# EAGLE schematic main (EAGLE 6.4)
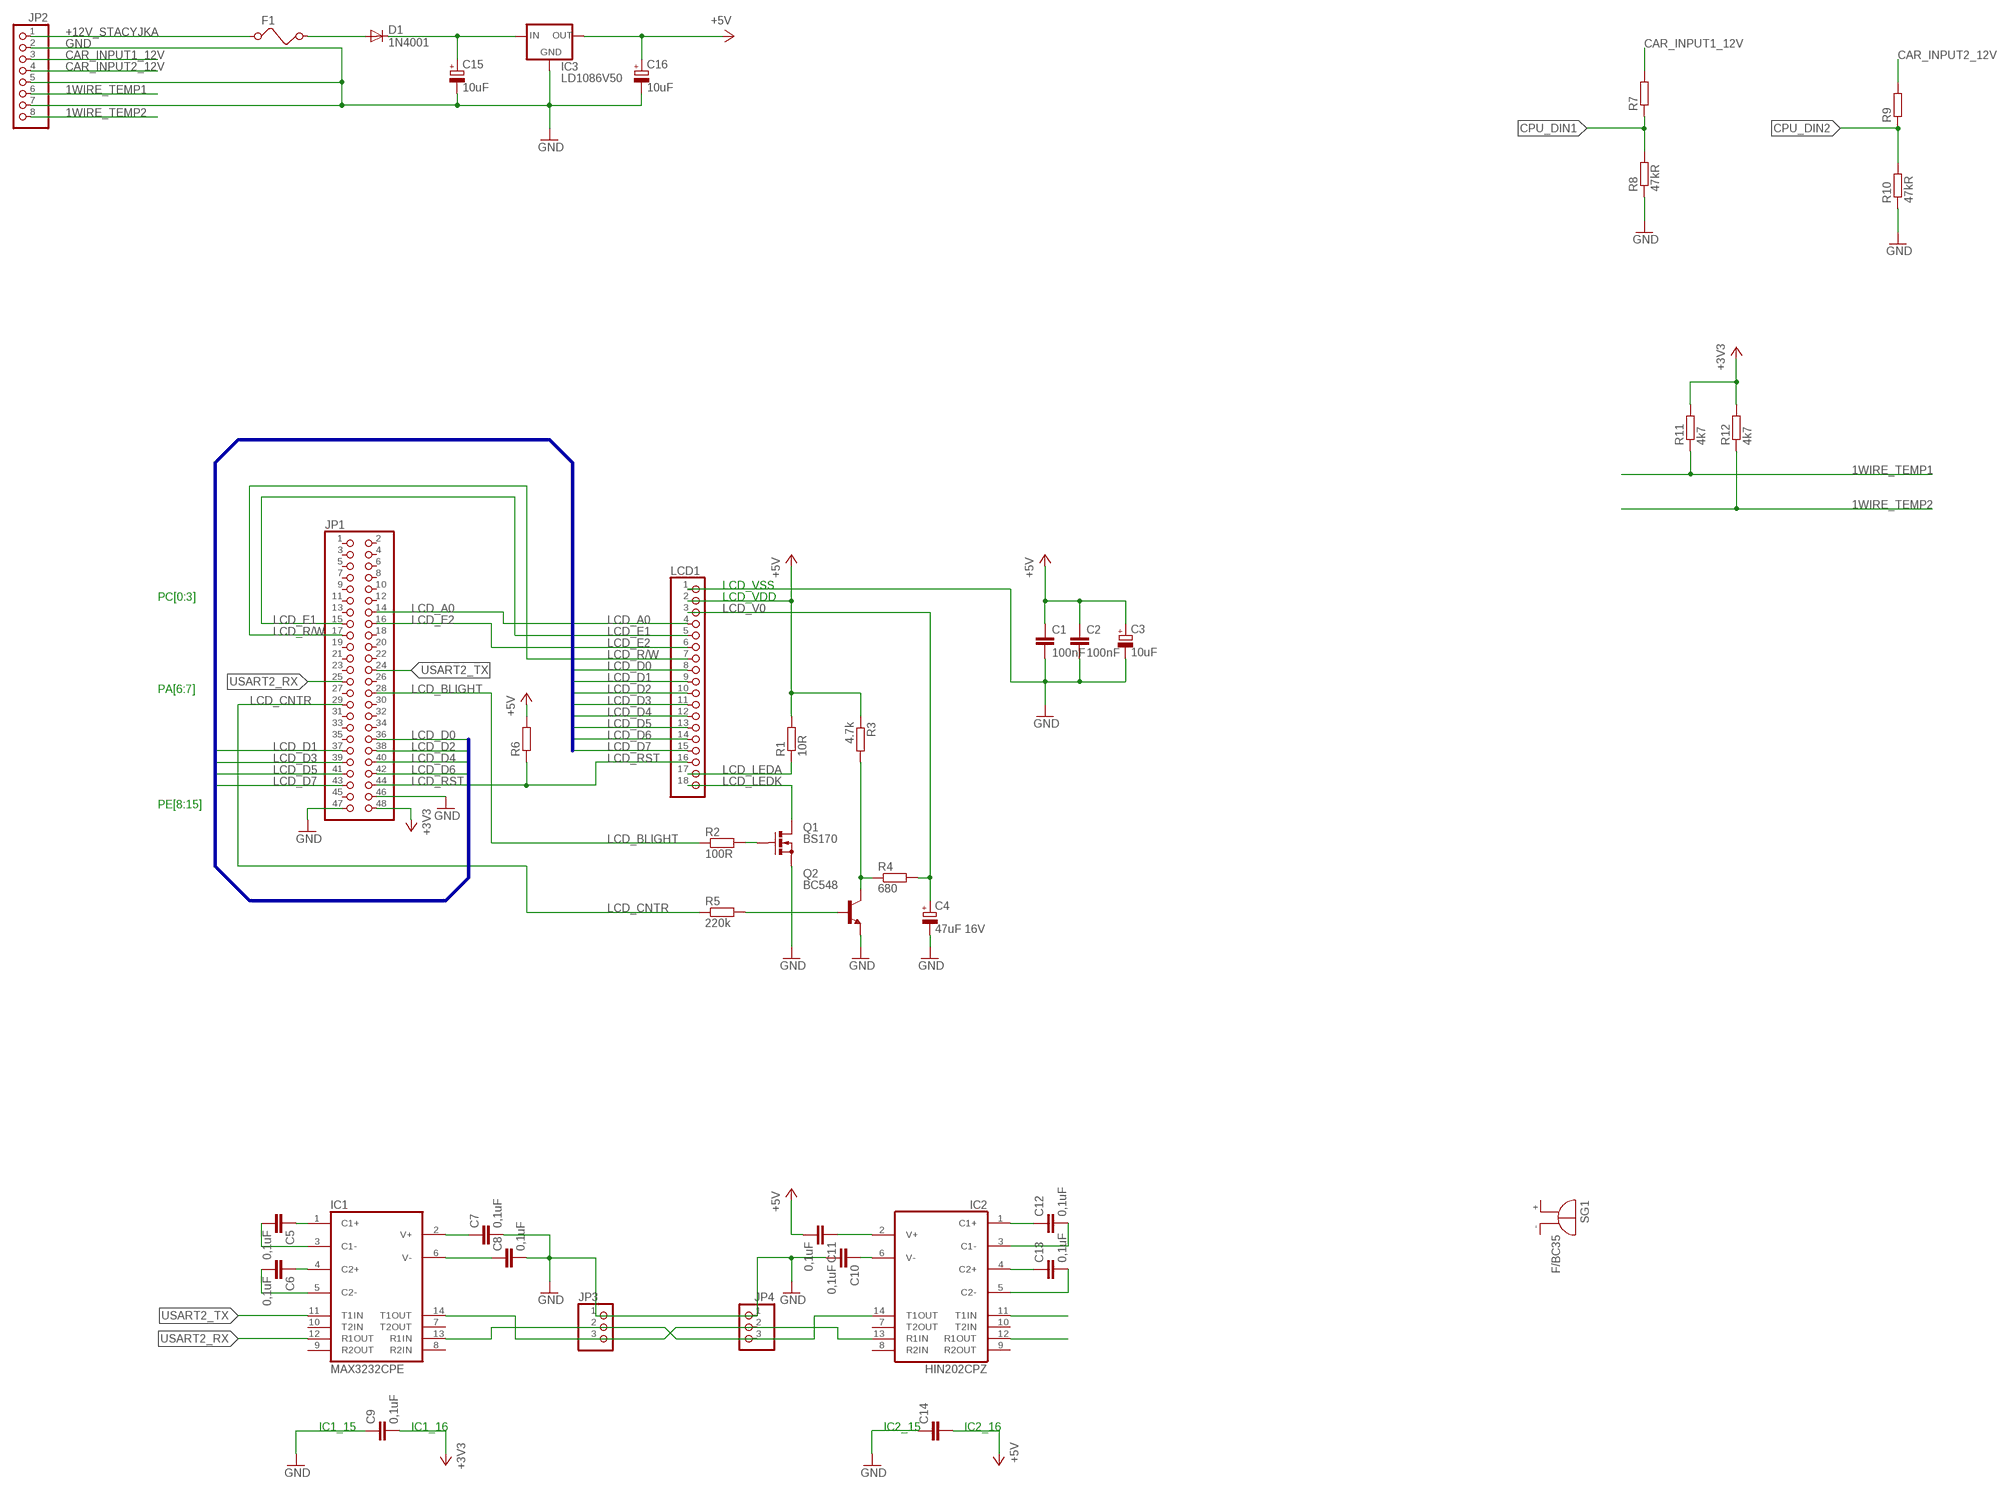
[diagram p0: schematic, sheet 1]

## Parts
C1  100nF  C-EU025-024X044  [C025-024X044]
C2  100nF  C-EU025-024X044  [C025-024X044]
C3  10uF  CPOL-EU085CS-1AR  [085CS_1AR]
C4  47uF 16V  CPOL-EU085CS-1AR  [085CS_1AR]
C5  0,1uF  C-EU025-024X044  [C025-024X044]
C6  0,1uF  C-EU025-024X044  [C025-024X044]
C7  0,1uF  C-EU025-024X044  [C025-024X044]
C8  0,1uF  C-EU025-024X044  [C025-024X044]
C9  0,1uF  C-EU025-024X044  [C025-024X044]
C10  0,1uF  C-EU025-024X044  [C025-024X044]
C11  0,1uF  C-EU025-024X044  [C025-024X044]
C12  0,1uF  C-EU025-024X044  [C025-024X044]
C13  0,1uF  C-EU025-024X044  [C025-024X044]
C14  C-EU025-024X044  [C025-024X044]
C15  10uF  CPOL-EU085CS-1AR  [085CS_1AR]
C16  10uF  CPOL-EU085CS-1AR  [085CS_1AR]
D1  1N4001  1N4004  [DO41-10]
F1  FUSE  [FUSE]
IC1  MAX3232CPE  [DIL16]
IC2  HIN202CPZ  MAX3232CPE  [DIL16]
IC3  LD1086V50  78MXXL  [78MXXL]
JP1  PINHD-2X24  [2X24]
JP2  PINHD-1X8  [1X08]
JP3  PINHD-1X3  [1X03]
JP4  PINHD-1X3  [1X03]
LCD1  PINHD-1X18  [1X18]
Q1  BS170  [SOT54E]
Q2  BC548  [TO92-EBC]
R1  10R  R-EU_0204/2V  [0204V]
R2  100R  R-EU_0204/2V  [0204V]
R3  4.7k  R-EU_0204/2V  [0204V]
R4  680  R-EU_0204/2V  [0204V]
R5  220k  R-EU_0204/2V  [0204V]
R6  R-EU_0204/2V  [0204V]
R7  R-EU_0204/2V  [0204V]
R8  47kR  R-EU_0204/2V  [0204V]
R9  R-EU_0204/2V  [0204V]
R10  47kR  R-EU_0204/2V  [0204V]
R11  4k7  R-EU_0204/2V  [0204V]
R12  4k7  R-EU_0204/2V  [0204V]
SG1  F/BC35  [F/BC35]

## Nets
1WIRE_TEMP1: JP2.6 R11.1
1WIRE_TEMP2: JP2.8 R12.1
+3V3: C9.2 JP1.48 R11.2 R12.2
+5V: C1.1 C2.1 C3.+ C11.2 C14.2 C16.+ IC3.OUT LCD1.2 R1.2 R3.1 R6.2
+12V_STACYJKA: F1.1 JP2.1
CAR_INPUT1_12V: JP2.3 R7.2
CAR_INPUT2_12V: JP2.4 R9.2
CPU_DIN1: R7.1 R8.2
CPU_DIN2: R9.1 R10.2
GND: C1.2 C2.2 C3.- C4.- C7.2 C8.2 C9.1 C10.2 C14.1 C15.- C16.- IC3.GND JP1.46 JP1.47 JP2.2 JP2.5 JP2.7 JP3.1 JP4.1 LCD1.1 Q1.S Q2.E R8.1 R10.1
LCD_A0: JP1.14 LCD1.4
LCD_BLIGHT: JP1.28 R2.1
LCD_CNTR: JP1.29 R5.1
LCD_D0: JP1.36 LCD1.8
LCD_D1: JP1.37 LCD1.9
LCD_D2: JP1.38 LCD1.10
LCD_D3: JP1.39 LCD1.11
LCD_D4: JP1.40 LCD1.12
LCD_D5: JP1.41 LCD1.13
LCD_D6: JP1.42 LCD1.14
LCD_D7: JP1.43 LCD1.15
LCD_E1: JP1.15 LCD1.5
LCD_E2: JP1.16 LCD1.6
LCD_LEDA: LCD1.17 R1.1
LCD_LEDK: LCD1.18 Q1.D
LCD_R/W: JP1.17 LCD1.7
LCD_RST: JP1.44 LCD1.16 R6.1
LCD_V0: C4.+ LCD1.3 R4.2
N$1: Q2.C R3.2 R4.1
N$2: Q1.G R2.2
N$3: Q2.B R5.2
N$4: C5.1 IC1.1(C1+)
N$5: C5.2 IC1.3(C1-)
N$6: C6.1 IC1.4(C2+)
N$7: C6.2 IC1.5(C2-)
N$8: C7.1 IC1.2(V+)
N$9: C8.1 IC1.6(V-)
N$10: C11.1 IC2.2(V+)
N$11: IC1.14(T1OUT) IC2.13(R1IN) JP3.3 JP4.2
N$12: C10.1 IC2.6(V-)
N$13: C12.1 IC2.1(C1+)
N$14: C12.2 IC2.3(C1-)
N$15: C13.1 IC2.4(C2+)
N$16: C13.2 IC2.5(C2-)
N$19: IC1.13(R1IN) IC2.14(T1OUT) JP3.2 JP4.3
N$20: IC2.11(T1IN)
N$21: IC2.12(R1OUT)
N$22: D1.A F1.2
N$23: C15.+ D1.C IC3.IN
USART2_RX: IC1.12(R1OUT) JP1.25
USART2_TX: IC1.11(T1IN) JP1.24
Unconnected: IC1.7(T2OUT) IC1.8(R2IN) IC1.9(R2OUT) IC1.10(T2IN) IC2.7(T2OUT) IC2.8(R2IN) IC2.9(R2OUT) IC2.10(T2IN) JP1.1 JP1.2 JP1.3 JP1.4 JP1.5 JP1.6 JP1.7 JP1.8 JP1.9 JP1.10 JP1.11 JP1.12 JP1.13 JP1.18 JP1.19 JP1.20 JP1.21 JP1.22 JP1.23 JP1.26 JP1.27 JP1.30 JP1.31 JP1.32 JP1.33 JP1.34 JP1.35 JP1.45 SG1.+ SG1.-

## Buses
B$1

## Notes on the sheet
- LCD_VSS
- PC[0:3] | LCD_VDD
- PA[6:7]
- PE[8:15]
- IC1_15 | IC1_16 | IC2_15 | IC2_16

## Power pins joined to a net without a drawn wire
GND: IC1.15(GND) IC2.15(GND)
VCC: IC1.16(VCC) IC2.16(VCC)

## Library data of the parts
C1 C2 C5-C14 = rcl:C-EU: CAPACITOR, European symbol
C3 C4 C15 C16 = rcl:CPOL-EU: POLARIZED CAPACITOR, European symbol
D1 = diode:1N4004: DIODE general purpose rectifier, 1 A
F1 = special:FUSE: FUSE 5 x 20 mm
IC1 IC2 = maxim:MAX3232*: True RS-232 Transceivers 3.0V to 5.5V, Low-Power up to 1Mbps, Using Four 0.1µF External Capacitors Source: http://pdfserv.maxim-ic.com/en/ds/MAX3222-MAX3241.pdf; MF: MAXIM; MPN: MAX3232CPE+; OC_FARNELL: 9724494; OC_NEWARK: 68K4626
IC3 = v-reg:78MXXL: VOLTAGE REGULATOR
JP1 = pinhead:PINHD-2X24: PIN HEADER
JP2 = pinhead:PINHD-1X8: PIN HEADER
JP3 JP4 = pinhead:PINHD-1X3: PIN HEADER
LCD1 = pinhead:PINHD-1X18: PIN HEADER
Q1 = transistor-small-signal:BS170: N-CHANNEL MOS FET
Q2 = transistor-npn:BC548*: NPN Transistor
R1-R12 = rcl:R-EU_: RESISTOR, European symbol
SG1 = buzzer:F/BC35: BUZZER Source: Spoerle; OC_FARNELL: unknown; OC_NEWARK: unknown